# EAGLE schematic BOSS-RoboClaw-Interface - Copy (EAGLE 9.6.2)

## Sheet 1 of 2
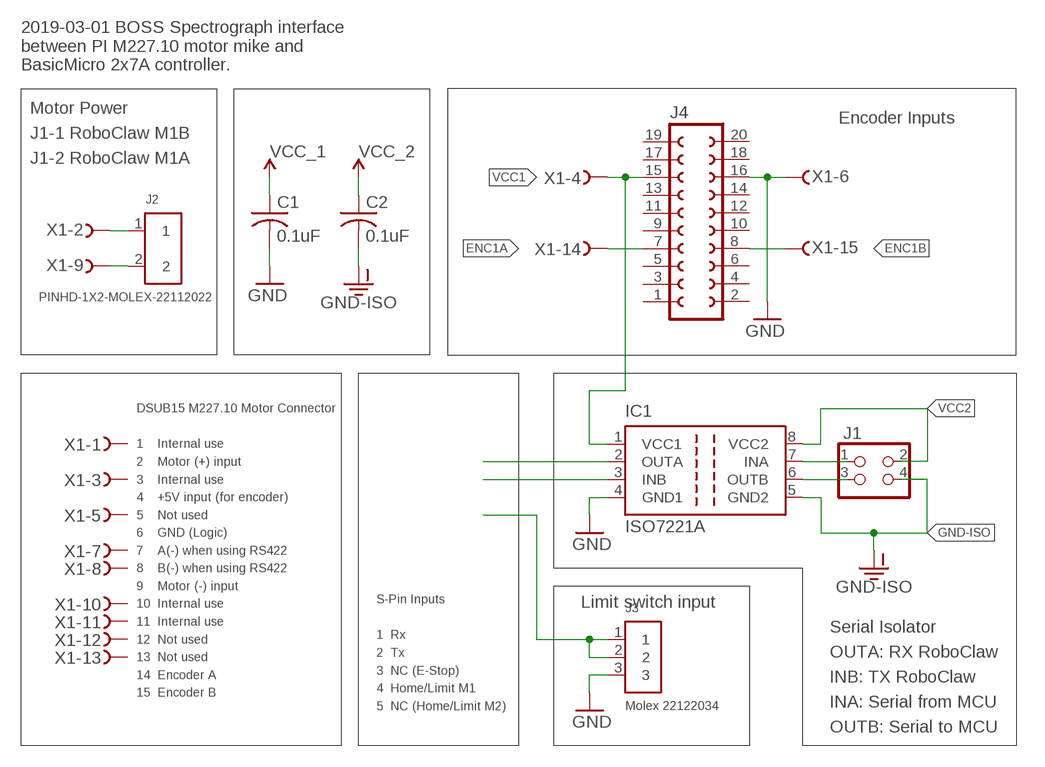
[diagram p0: schematic, sheet 1]

### Parts
C1  0.1uF  C-USC0805  [C0805]
C2  0.1uF  C-USC0805  [C0805]
IC1  ISO7221A  [SO-08]
J1  PINHD-2X2AMP-75869-130LF  [2X02-SHROUD]
J2  PINHD-1X2-MOLEX-22112022  [1X02-MOLEX-22112022]
J3  Molex 22122034  PINHD-1X3RA-MOLEX-22122034  [1X03RA-MOLEX-22122034]
J4  FE10-2SAMTEC-ESW-110-44-S-D  [FE10-2-SAMTEC-ESW-110-44-S-D]
X1  Amphenol L77SDAH15SOL2RM8C309  D-SUB15-H2R15ST  [H2R15ST]

### Nets
ENC1A: J4.7 X1.14
ENC1B: J4.8 X1.15
GND: C1.2 IC1.4(GND1) J3.3 J4.16 X1.6
GND-ISO: C2.2 IC1.5(GND2) J1.4
LIMIT/HOME: J3.1 J3.2
M1A: J2.2 X1.9
M1B: J2.1 X1.2
N$1: IC1.7(INA) J1.1
N$2: IC1.6(OUTB) J1.3
RX: IC1.2(OUTA)
TX: IC1.3(INB)
VCC1: C1.1 IC1.1(VCC1) J4.15 X1.4 ; supply symbol labelled VCC_1
VCC2: C2.1 IC1.8(VCC2) J1.2 ; supply symbol labelled VCC_2
Unconnected: J4.1 J4.2 J4.3 J4.4 J4.5 J4.6 J4.9 J4.10 J4.11 J4.12 J4.13 J4.14 J4.17 J4.18 J4.19 J4.20 X1.1 X1.3 X1.5 X1.7 X1.8 X1.10 X1.11 X1.12 X1.13

### Notes on the sheet
- 2019-03-01 BOSS Spectrograph interface
  between PI M227.10 motor mike and
  BasicMicro 2x7A controller.
- Encoder Inputs
- Motor Power
  J1-1 RoboClaw M1B
  J1-2 RoboClaw M1A
- Limit switch input
- DSUB15 M227.10 Motor Connector
  
  1    Internal use
  2    Motor (+) input
  3    Internal use
  4    +5V input (for encoder)
  5    Not used
  6    GND (Logic)
  7    A(-) when using RS422
  8    B(-) when using RS422
  9    Motor (-) input
  10  Internal use
  11  Internal use
  12  Not used
  13  Not used
  14  Encoder A
  15  Encoder B
- S-Pin Inputs
  
  1  Rx
  2  Tx
  3  NC (E-Stop)
  4  Home/Limit M1
  5  NC (Home/Limit M2)
- Serial Isolator
  OUTA: RX RoboClaw
  INB: TX RoboClaw
  INA: Serial from MCU
  OUTB: Serial to MCU

## Sheet 2 of 2
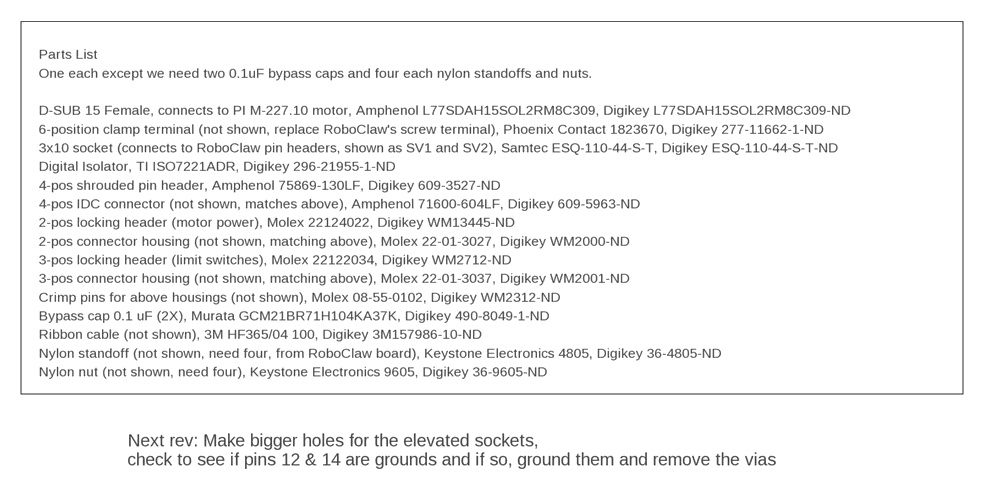
[diagram p1: schematic, sheet 2]

### Notes on the sheet
- Parts List
  One each except we need two 0.1uF bypass caps and four each nylon standoffs and nuts.
  
  D-SUB 15 Female, connects to PI M-227.10 motor, Amphenol L77SDAH15SOL2RM8C309, Digikey L77SDAH15SOL2RM8C309-ND
  6-position clamp terminal (not shown, replace RoboClaw's screw terminal), Phoenix Contact 1823670, Digikey 277-11662-1-ND
  3x10 socket (connects to RoboClaw pin headers, shown as SV1 and SV2), Samtec ESQ-110-44-S-T, Digikey ESQ-110-44-S-T-ND
  Digital Isolator, TI ISO7221ADR, Digikey 296-21955-1-ND
  4-pos shrouded pin header, Amphenol 75869-130LF, Digikey 609-3527-ND
  4-pos IDC connector (not shown, matches above), Amphenol 71600-604LF, Digikey 609-5963-ND
  2-pos locking header (motor power), Molex 22124022, Digikey WM13445-ND
  2-pos connector housing (not shown, matching above), Molex 22-01-3027, Digikey WM2000-ND
  3-pos locking header (limit switches), Molex 22122034, Digikey WM2712-ND
  3-pos connector housing (not shown, matching above), Molex 22-01-3037, Digikey WM2001-ND
  Crimp pins for above housings (not shown), Molex 08-55-0102, Digikey WM2312-ND
  Bypass cap 0.1 uF (2X), Murata GCM21BR71H104KA37K, Digikey 490-8049-1-ND
  Ribbon cable (not shown), 3M HF365/04 100, Digikey 3M157986-10-ND
  Nylon standoff (not shown, need four, from RoboClaw board), Keystone Electronics 4805, Digikey 36-4805-ND
  Nylon nut (not shown, need four), Keystone Electronics 9605, Digikey 36-9605-ND
- Next rev: Make bigger holes for the elevated sockets,
  check to see if pins 12 & 14 are grounds and if so, ground them and remove the vias

## Library data of the parts
C1 C2 = AUmlib:C-US: CAPACITOR, American symbol; SPICEPREFIX: C
IC1 = AUmlib:ISO7221: DUAL DIGITAL ISOLATORS Source: http://focus.ti.com/lit/ds/symlink/iso7221a.pdf; MPN: ISO7221AD; OC_FARNELL: 1390651; OC_NEWARK: 48M0672
J1 = AUmlib:PINHD-2X2: PIN HEADER
J2 = AUmlib:PINHD-1X2-MOLEX-22112022
J3 = AUmlib:PINHD-1X3RA-MOLEX-22122034
J4 = AUmlib:FE10-2: FEMALE HEADER
X1 = AUmlib:D-SUB15-: D-Subminiatur Connector Source: Electronioc Interconnects European Edition 1998; OC_FARNELL: unknown; OC_NEWARK: unknown